# EAGLE design ExpansionBoardV1 (EAGLE 7.3.0)
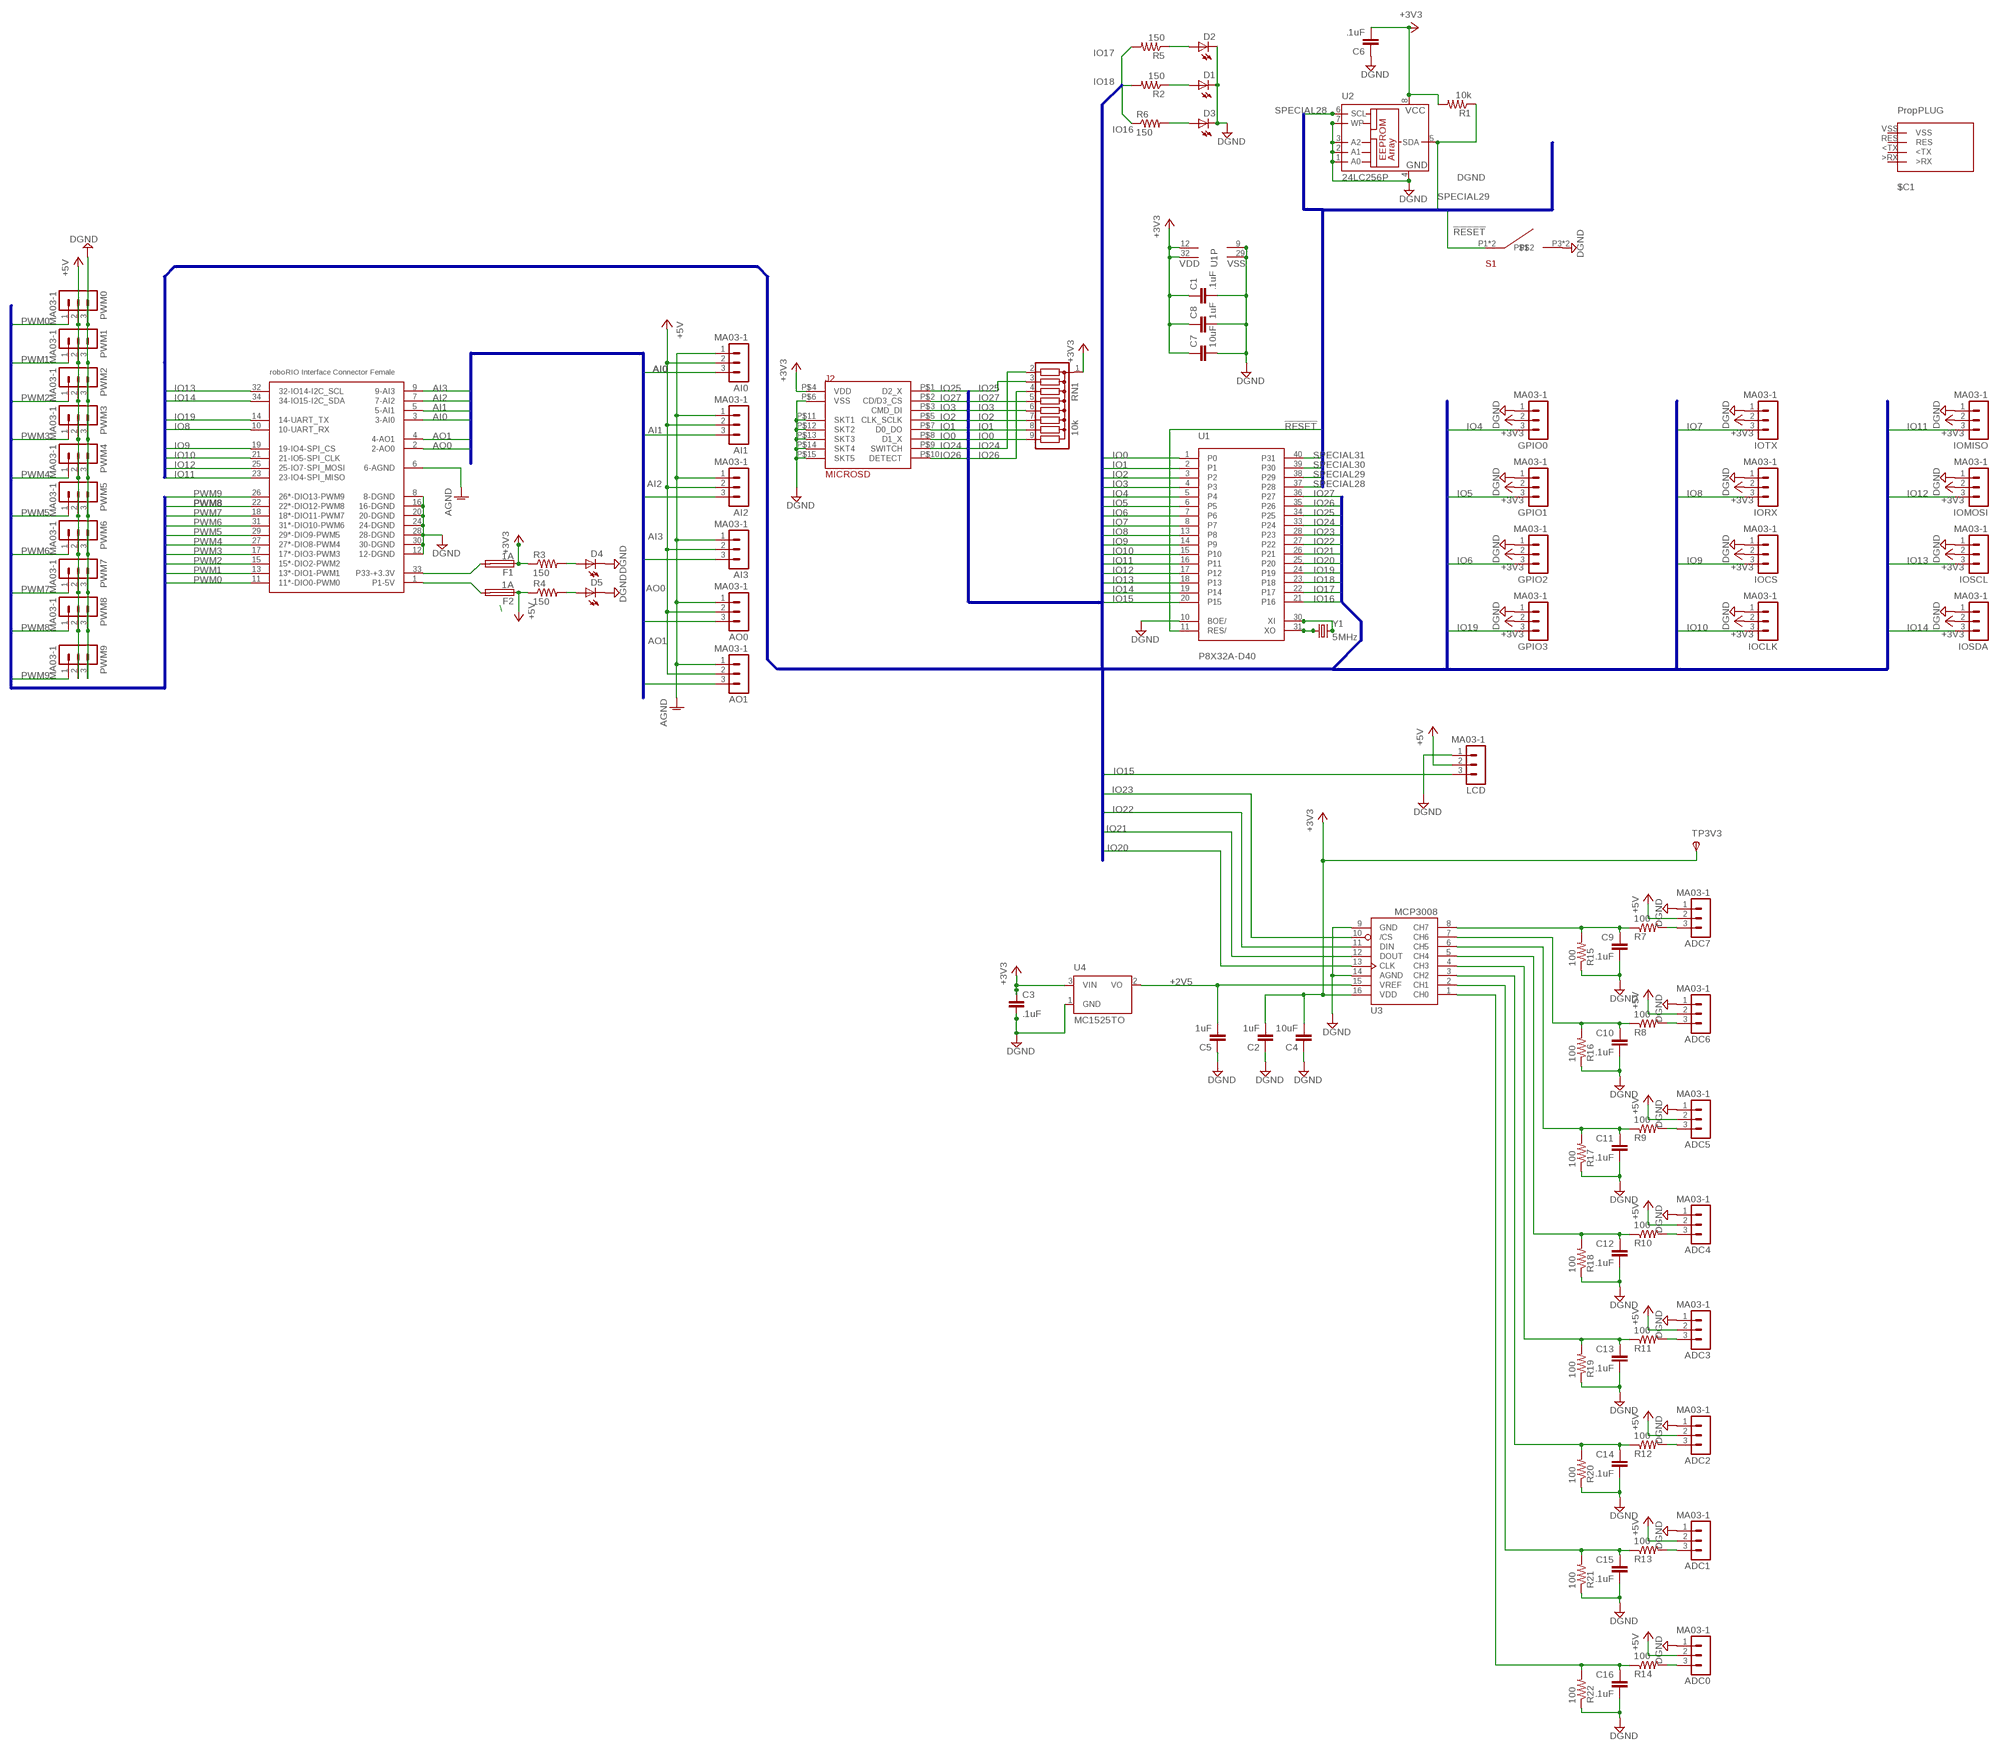
[diagram p0: schematic, sheet 1]

## Parts
ADC0  MA03-1  [MA03-1]
ADC1  MA03-1  [MA03-1]
ADC2  MA03-1  [MA03-1]
ADC3  MA03-1  [MA03-1]
ADC4  MA03-1  [MA03-1]
ADC5  MA03-1  [MA03-1]
ADC6  MA03-1  [MA03-1]
ADC7  MA03-1  [MA03-1]
AI0  MA03-1  [MA03-1]
AI1  MA03-1  [MA03-1]
AI2  MA03-1  [MA03-1]
AI3  MA03-1  [MA03-1]
AO0  MA03-1  [MA03-1]
AO1  MA03-1  [MA03-1]
C1  .1uF  C5/2.5  [C5B2.5]
C2  1uF  C5/2.5  [C5B2.5]
C3  .1uF  C5/2.5  [C5B2.5]
C4  10uF  C5/2.5  [C5B2.5]
C5  1uF  C5/2.5  [C5B2.5]
C6  .1uF  C5/2.5  [C5B2.5]
C7  10uF  C5/2.5  [C5B2.5]
C8  1uF  C5/2.5  [C5B2.5]
C9  .1uF  C5/2.5  [C5B2.5]
C10  .1uF  C5/2.5  [C5B2.5]
C11  .1uF  C5/2.5  [C5B2.5]
C12  .1uF  C5/2.5  [C5B2.5]
C13  .1uF  C5/2.5  [C5B2.5]
C14  .1uF  C5/2.5  [C5B2.5]
C15  .1uF  C5/2.5  [C5B2.5]
C16  .1uF  C5/2.5  [C5B2.5]
D1  LED5MM  [LED5MM]
D2  LED5MM  [LED5MM]
D3  LED5MM  [LED5MM]
D4  LED5MM  [LED5MM]
D5  LED5MM  [LED5MM]
F1  1A  TR5  [TR5]
F2  1A  TR5  [TR5]
GPIO0  MA03-1  [MA03-1]
GPIO1  MA03-1  [MA03-1]
GPIO2  MA03-1  [MA03-1]
GPIO3  MA03-1  [MA03-1]
IOCLK  MA03-1  [MA03-1]
IOCS  MA03-1  [MA03-1]
IOMISO  MA03-1  [MA03-1]
IOMOSI  MA03-1  [MA03-1]
IORX  MA03-1  [MA03-1]
IOSCL  MA03-1  [MA03-1]
IOSDA  MA03-1  [MA03-1]
IOTX  MA03-1  [MA03-1]
J1  RRINTERFACE-FEMALE  [RRINT-FEMALE]
J2  MICROSD  [MICRO_SD_PUSH-PUSH]
LCD  MA03-1  [MA03-1]
P1  PROP_PLUG  [PROP_PLUG]
PWM0  MA03-1  [MA03-1]
PWM1  MA03-1  [MA03-1]
PWM2  MA03-1  [MA03-1]
PWM3  MA03-1  [MA03-1]
PWM4  MA03-1  [MA03-1]
PWM5  MA03-1  [MA03-1]
PWM6  MA03-1  [MA03-1]
PWM7  MA03-1  [MA03-1]
PWM8  MA03-1  [MA03-1]
PWM9  MA03-1  [MA03-1]
R1  10k  R-US_0204/7  [0204/7]
R2  150  R-US_0204/7  [0204/7]
R3  150  R-US_0204/7  [0204/7]
R4  150  R-US_0204/7  [0204/7]
R5  150  R-US_0204/7  [0204/7]
R6  150  R-US_0204/7  [0204/7]
R7  100  R-US_0204/7  [0204/7]
R8  100  R-US_0204/7  [0204/7]
R9  100  R-US_0204/7  [0204/7]
R10  100  R-US_0204/7  [0204/7]
R11  100  R-US_0204/7  [0204/7]
R12  100  R-US_0204/7  [0204/7]
R13  100  R-US_0204/7  [0204/7]
R14  100  R-US_0204/7  [0204/7]
R15  100  R-US_0204/7  [0204/7]
R16  100  R-US_0204/7  [0204/7]
R17  100  R-US_0204/7  [0204/7]
R18  100  R-US_0204/7  [0204/7]
R19  100  R-US_0204/7  [0204/7]
R20  100  R-US_0204/7  [0204/7]
R21  100  R-US_0204/7  [0204/7]
R22  100  R-US_0204/7  [0204/7]
RN1  10k  G08R  [SIL9]
S1  BUTTON  [RESETBUTTON300000MILLION]
TP3V3  TPSPAD1-13  [P1-13]
U1  P8X32A-D40  [P8X32A-D40]
U2  24LC256P  [DIL8]
U3  MCP3008  [DIL16]
U4  MC1525TO  [TO92]
U$1  24LC256(MICROCHIP)  [24LC256]  (not placed on a sheet)
U$2  24LC256(MICROCHIP)  [24LC256]  (not placed on a sheet)
Y1  5MHz  CRYSTALHC49U70  [HC49U70]

## Nets
!RESET: S1.P1 S1.P2 U1.11(RES/)
+2V5: C5.2 U3.15(VREF) U4.2(VO)
+3V3: C1.1 C2.2 C3.1 C4.2 C6.2 C7.1 C8.1 F1.1 GPIO0.2 GPIO1.2 GPIO2.2 GPIO3.2 IOCLK.2 IOCS.2 IOMISO.2 IOMOSI.2 IORX.2 IOSCL.2 IOSDA.2 IOTX.2 J2.P$4(VDD) R1.2 R3.1 RN1.1 TP3V3.TP(PP) U1.12(VDD) U1.32(VDD) U2.8(VCC) U3.16(VDD) U4.3(VIN)
+5V: ADC0.2 ADC1.2 ADC2.2 ADC3.2 ADC4.2 ADC5.2 ADC6.2 ADC7.2 AI0.2 AI1.2 AI2.2 AI3.2 AO0.2 AO1.2 F2.1 LCD.2 PWM0.2 PWM1.2 PWM2.2 PWM3.2 PWM4.2 PWM5.2 PWM6.2 PWM7.2 PWM8.2 PWM9.2 R4.1
AGND: AI0.1 AI1.1 AI2.1 AI3.1 AO0.1 AO1.1 J1.6(6-AGND)
AI0: AI0.3 J1.3(3-AI0)
AI1: AI1.3 J1.5(5-AI1)
AI2: AI2.3 J1.7(7-AI2)
AI3: AI3.3 J1.9(9-AI3)
AO0: AO0.3 J1.2(2-AO0)
AO1: AO1.3 J1.4(4-AO1)
DGND: ADC0.1 ADC1.1 ADC2.1 ADC3.1 ADC4.1 ADC5.1 ADC6.1 ADC7.1 C1.2 C2.1 C3.2 C4.1 C5.1 C6.1 C7.2 C8.2 C9.2 C10.2 C11.2 C12.2 C13.2 C14.2 C15.2 C16.2 D1.K(C) D2.K(C) D3.K(C) D4.K(C) D5.K(C) GPIO0.1 GPIO1.1 GPIO2.1 GPIO3.1 IOCLK.1 IOCS.1 IOMISO.1 IOMOSI.1 IORX.1 IOSCL.1 IOSDA.1 IOTX.1 J1.8(8-DGND) J1.12(12-DGND) J1.16(16-DGND) J1.20(20-DGND) J1.24(24-DGND) J1.28(28-DGND) J1.30(30-DGND) J2.P$6(VSS) J2.P$11(SKT1) J2.P$12(SKT2) J2.P$13(SKT3) J2.P$14(SKT4) J2.P$15(SKT5) LCD.1 PWM0.3 PWM1.3 PWM2.3 PWM3.3 PWM4.3 PWM5.3 PWM6.3 PWM7.3 PWM8.3 PWM9.3 R15.1 R16.1 R17.1 R18.1 R19.1 R20.1 R21.1 R22.1 S1.P3 S1.P4 U1.9(VSS) U1.10(BOE/) U1.29(VSS) U2.1(A0) U2.2(A1) U2.3(A2) U2.4(GND) U2.7(WP) U3.9(GND) U3.14(AGND) U4.1(GND)
IO0: J2.P$8(D1_X) RN1.9 U1.1(P0)
IO1: J2.P$7(D0_DO) RN1.8 U1.2(P1)
IO2: J2.P$5(CLK_SCLK) RN1.7 U1.3(P2)
IO3: J2.P$3(CMD_DI) RN1.6 U1.4(P3)
IO4: GPIO0.3 U1.5(P4)
IO5: GPIO1.3 U1.6(P5)
IO6: GPIO2.3 U1.7(P6)
IO7: IOTX.3 U1.8(P7)
IO8: IORX.3 J1.10(10-UART_RX) U1.13(P8)
IO9: IOCS.3 J1.19(19-IO4-SPI_CS) U1.14(P9)
IO10: IOCLK.3 J1.21(21-IO5-SPI_CLK) U1.15(P10)
IO11: IOMISO.3 J1.23(23-IO4-SPI_MISO) U1.16(P11)
IO12: IOMOSI.3 J1.25(25-IO7-SPI_MOSI) U1.17(P12)
IO13: IOSCL.3 J1.32(32-IO14-I2C_SCL) U1.18(P13)
IO14: IOSDA.3 J1.34(34-IO15-I2C_SDA) U1.19(P14)
IO15: LCD.3 U1.20(P15)
IO16: R6.1 U1.21(P16)
IO17: R5.2 U1.22(P17)
IO18: R2.2 U1.23(P18)
IO19: GPIO3.3 J1.14(14-UART_TX) U1.24(P19)
IO20: U1.25(P20) U3.13(CLK)
IO21: U1.26(P21) U3.12(DOUT)
IO22: U1.27(P22) U3.11(DIN)
IO23: U1.28(P23) U3.10(/CS)
IO24: J2.P$9(SWITCH) RN1.2 U1.33(P24)
IO25: J2.P$1(D2_X) RN1.3 U1.34(P25)
IO26: J2.P$10(DETECT) RN1.4 U1.35(P26)
IO27: J2.P$2(CD/D3_CS) RN1.5 U1.36(P27)
L1: D4.A R3.2
N$1: U1.31(XO) Y1.1
N$2: U1.30(XI) Y1.2
N$4: D5.A R4.2
N$5: F1.2 J1.33(P33-+3.3V)
N$7: ADC1.3 R13.2
N$8: C16.1 R14.1 R22.2 U3.1(CH0)
N$9: C15.1 R13.1 R21.2 U3.2(CH1)
N$10: C13.1 R11.1 R19.2 U3.4(CH3)
N$12: D3.A R6.2
N$13: D1.A R2.1
N$14: D2.A R5.1
N$15: F2.2 J1.1(P1-5V)
N$16: C14.1 R12.1 R20.2 U3.3(CH2)
N$17: C12.1 R10.1 R18.2 U3.5(CH4)
N$22: ADC2.3 R12.2
N$25: ADC3.3 R11.2
N$29: ADC4.3 R10.2
N$30: C11.1 R9.1 R17.2 U3.6(CH5)
N$31: ADC5.3 R9.2
N$33: ADC0.3 R14.2
N$34: C9.1 R7.1 R15.2 U3.8(CH7)
N$35: ADC6.3 R8.2
N$36: ADC7.3 R7.2
N$40: C10.1 R8.1 R16.2 U3.7(CH6)
PWM0: J1.11(11*-DIO0-PWM0) PWM0.1
PWM1: J1.13(13*-DIO1-PWM1) PWM1.1
PWM2: J1.15(15*-DIO2-PWM2) PWM2.1
PWM3: J1.17(17*-DIO3-PWM3) PWM3.1
PWM4: J1.27(27*-DIO8-PWM4) PWM4.1
PWM5: J1.29(29*-DIO9-PWM5) PWM5.1
PWM6: J1.31(31*-DIO10-PWM6) PWM6.1
PWM7: J1.18(18*-DIO11-PWM7) PWM7.1
PWM8: J1.22(22*-DIO12-PWM8) PWM8.1
PWM9: J1.26(26*-DIO13-PWM9) PWM9.1
SPECIAL28: U1.37(P28) U2.6(SCL)
SPECIAL29: R1.1 U1.38(P29) U2.5(SDA)
SPECIAL30: U1.39(P30)
SPECIAL31: U1.40(P31)
Unconnected: P1.<TX P1.>RX P1.RES P1.VSS

## Buses
SPECIAL[28..31],!RESET
IO[0..31],UART_TX,UART_RX,I2C_SCL,I2C_SDA
IO[0..31],AI[0..3],AO[0..1],DIO[0..3],DIO[8..13],UART_TX,UART_RX,IO0,I2C_SCL,I2C_SDA
PWM[0..9]

## Notes on the sheet
- \

## Library data of the parts
ADC0 ADC1-ADC7 AI0 AI1-AI3 AO0 AO1 GPIO0 GPIO1-GPIO3 IOCLK IOCS IOMISO IOMOSI IORX IOSCL IOSDA IOTX LCD PWM0 PWM1-PWM9 = con-lstb-modified:MA03-1: PIN HEADER; OC_FARNELL: unknown; OC_NEWARK: unknown
C1-C16 = capacitor-wima:C: CAPACITOR naming: grid - package width
D1-D5 = led:LED: LED OSRAM: - CHIPLED LG R971, LG N971, LY N971, LG Q971, LY Q971, LO R971, LY R971 LH N974, LH R974 LS Q976, LO Q976, LY Q976 LO Q996 - Hyper CHIPLED LW Q18S LB Q993, LB Q99A, LB R99A - SideLED LS A670, LO A670, LY A670, LG A670, LP A670 LB A673, LV A673, LT A673, LW A673 LH A674 LY A675 LS A676, LA A676, LO A676, LY A676, LW A676 LS A679, LY A679, LG A679 - Hyper Micro SIDELED® LS Y876, LA Y876, LO Y876, LY Y876 LT Y87S - SmartLED LW L88C, LW L88S LB L89C, LB L89S, LG L890 LS L89K, LO L89K, LY L89K LS L896, LA L896, LO L896, LY L896 - TOPLED LS T670, LO T670, LY T670, LG T670, LP T670 LSG T670, LSP T670, LSY T670, LOP T670, LYG T670 LG T671, LOG T671, LSG T671 LB T673, LV T673, LT T673, LW T673 LH T674 LS T676, LA T676, LO T676, LY T676, LB T676, LH T676, LSB T676, LW T676 LB T67C, LV T67C, LT T67C, LS T67K, LO T67K, LY T67K, LW E67C LS E67B, LA E67B, LO E67B, LY E67B, LB E67C, LV E67C, LT E67C LW T67C LS T679, LY T679, LG T679 LS T770, LO T770, LY T770, LG T770, LP T770 LB T773, LV T773, LT T773, LW T773 LH T774 LS E675, LA E675, LY E675, LS T675 LS T776, LA T776, LO T776, LY T776, LB T776 LHGB T686 LT T68C, LB T68C - Hyper Mini TOPLED® LB M676 - Mini TOPLED Santana® LG M470 LS M47K, LO M47K, LY M47K Source: http://www.osram.convergy.de LUXEON: - LUMILED® LXK2-PW12-R00, LXK2-PW12-S00, LXK2-PW14-U00, LXK2-PW14-V00 LXK2-PM12-R00, LXK2-PM12-S00, LXK2-PM14-U00 LXK2-PE12-Q00, LXK2-PE12-R00, LXK2-PE12-S00, LXK2-PE14-T00, LXK2-PE14-U00 LXK2-PB12-K00, LXK2-PB12-L00, LXK2-PB12-M00, LXK2-PB14-N00, LXK2-PB14-P00, LXK2-PB14-Q00 LXK2-PR12-L00, LXK2-PR12-M00, LXK2-PR14-Q00, LXK2-PR14-R00 LXK2-PD12-Q00, LXK2-PD12-R00, LXK2-PD12-S00 LXK2-PH12-R00, LXK2-PH12-S00 LXK2-PL12-P00, LXK2-PL12-Q00, LXK2-PL12-R00 Source: www.luxeon.com KINGBRIGHT: KA-3528ASYC Source: www.kingbright.com
F1 F2 = fuse:TR5: FUSE Wickmann; OC_FARNELL: unknown; OC_NEWARK: unknown
J1 = RoboRioConnector:RRINTERFACE-FEMALE
J2 = MicroSdSocket:MICROSD
P1 = PropPlug:PROP_PLUG: Propeller Plug This is a simple Propeller Plug (PropPLUG) design.
R1-R22 = resistor:R-US_: RESISTOR, American symbol
RN1 = resistor-sil:G08R: SIL RESISTOR; OC_FARNELL: unknown; OC_NEWARK: unknown
S1 = RESETBUTTON3000:BUTTON
TP3V3 = testpad:TPS: TEST PIN
U1 = parallax_propeller (1):P8X32A-D40
U2 = microchip:24*: Serial EEPROM I2C; MF: MICROCHIP; MPN: 24LC256-E/P; OC_FARNELL: 9757970; OC_NEWARK: 92C7169
U3 = adafruit:MCP3008
U4 = microchip:MC15*: 2.5V and 4.096V Voltage References Source: http://www.microchip.com .. 21653b.pdf; OC_FARNELL: unknown; OC_NEWARK: unknown
U$1 U$2 = 24LC256:24LC256(MICROCHIP)
Y1 = crystal:CRYSTAL: CRYSTAL; OC_FARNELL: unknown; OC_NEWARK: unknown

## Board
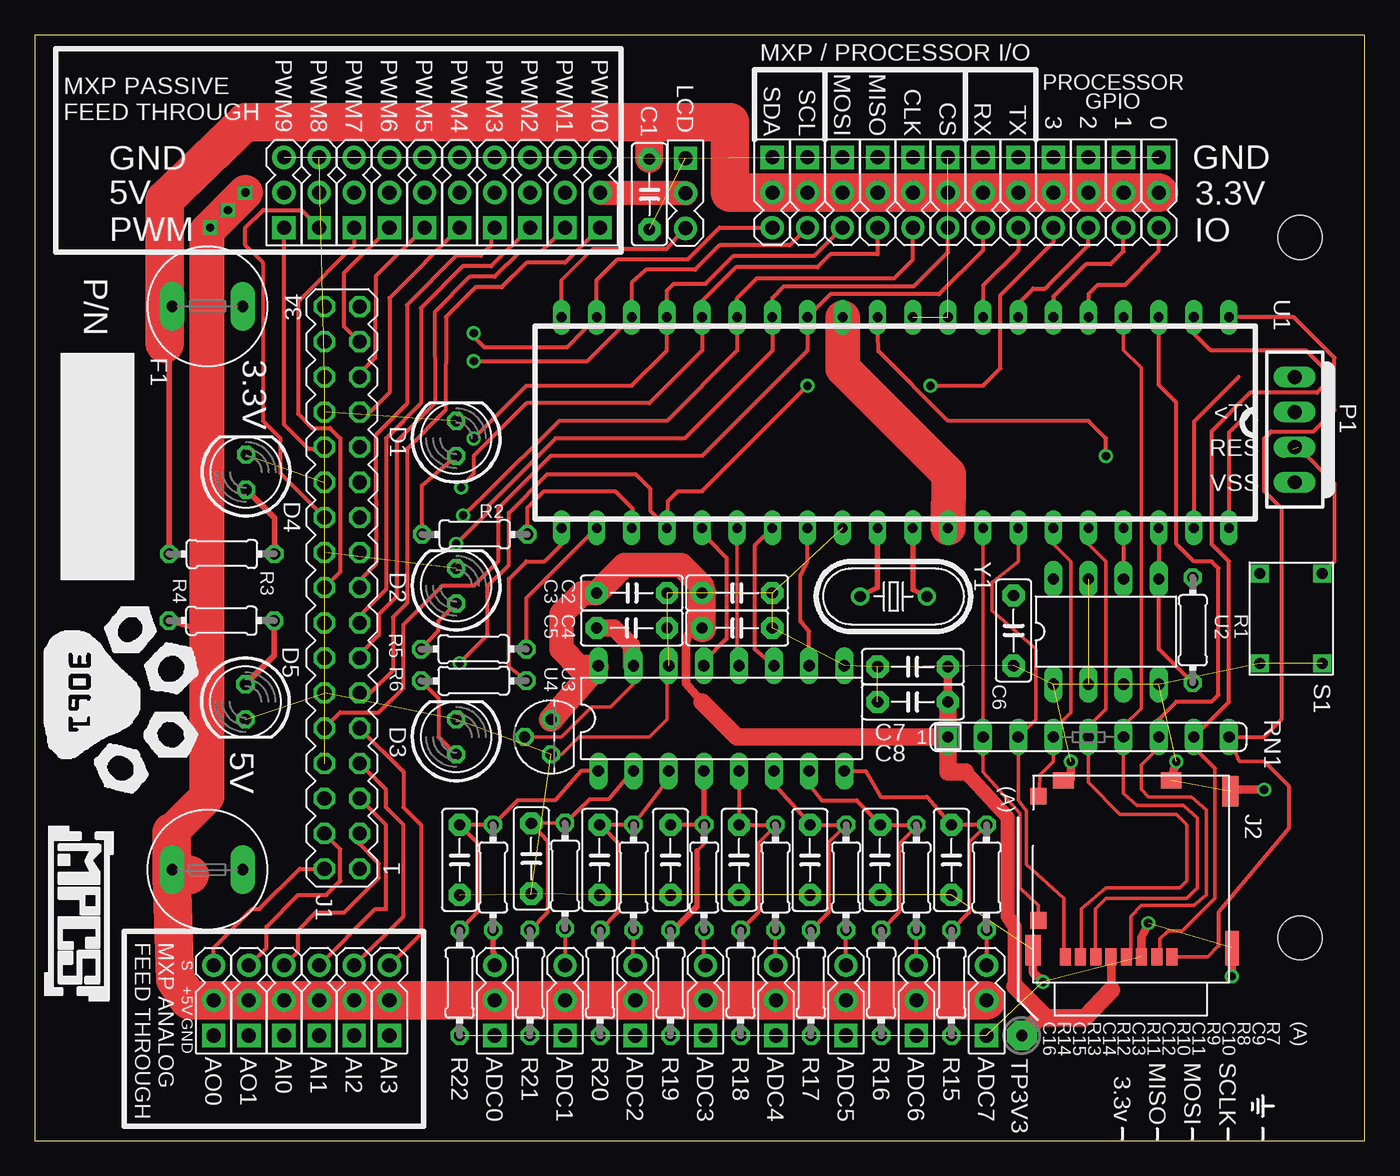
[diagram p1: board, top side]
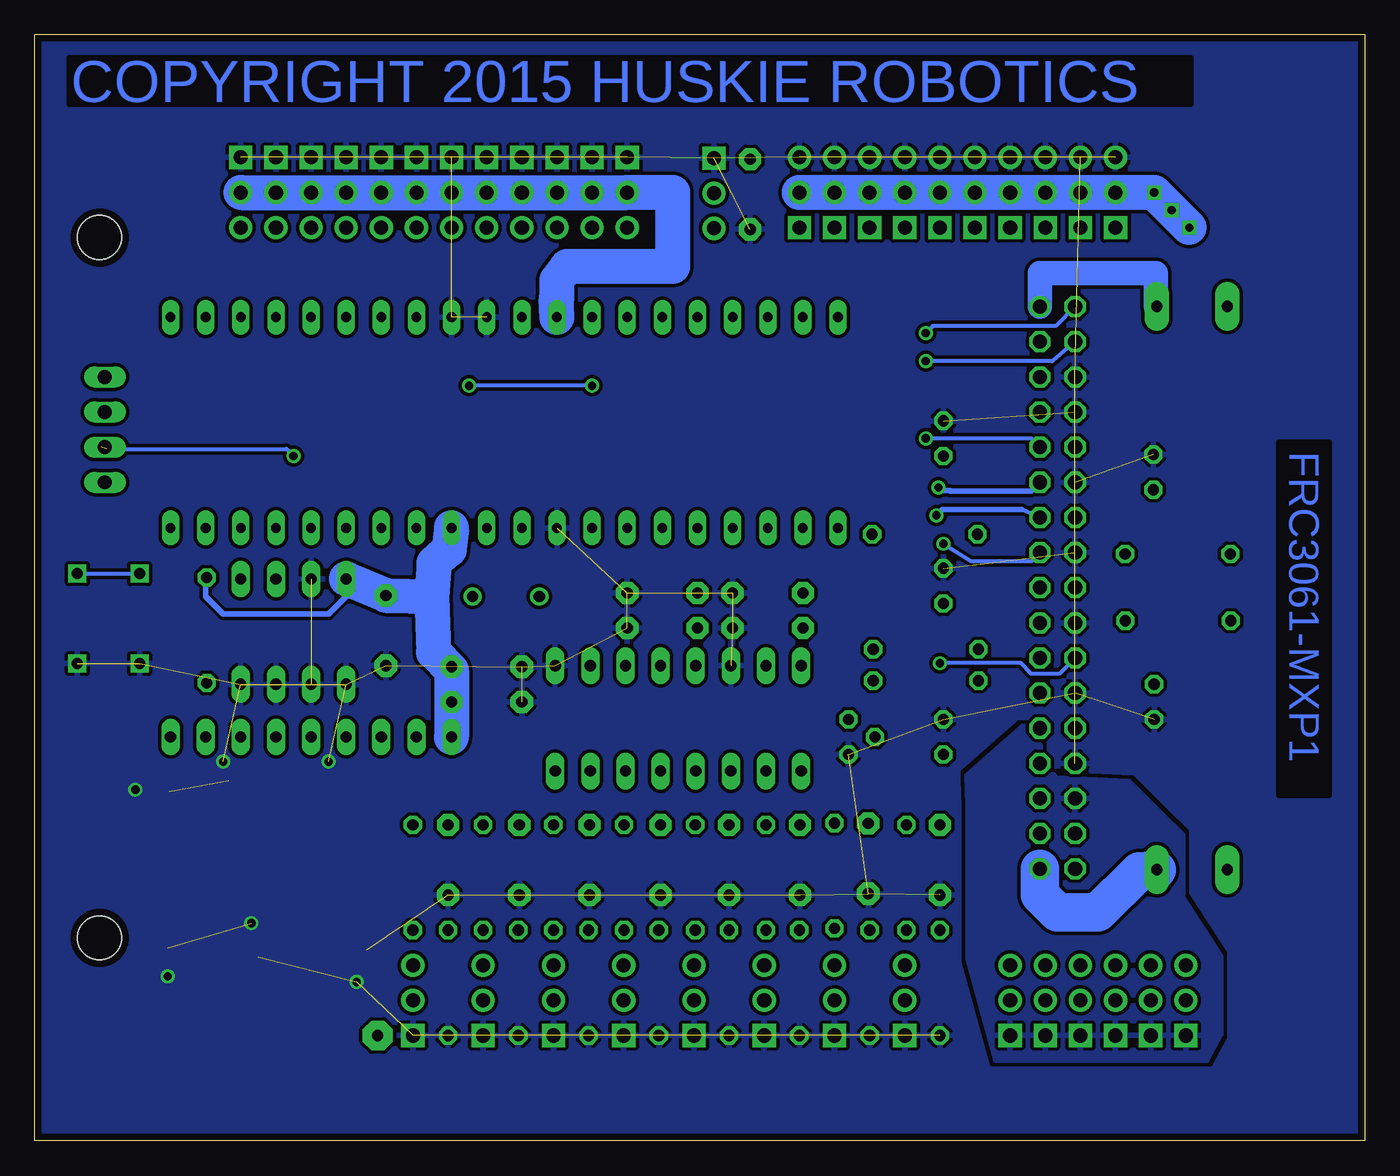
[diagram p2: board, bottom side, seen from below]

Size 96.19 x 80 mm. Coordinates in mm from the lower left corner, seen from the top.
Outline: 0,0 96.19,0 96.19,80 0,80 0,0
Copper layers (1*16): Top 0.035mm / dielectric 1.5mm / Bottom 0.035mm
Design rules "defaultTemp": minimum track width 10mil, minimum drill 23mil, track to track 8mil, track to pad 8mil, pad to pad 8mil, via to via 8mil, smd to smd 8mil, copper to edge 20mil, drill to drill 8mil, minimum pad ring 10mil, minimum via ring 8mil, stop-mask expansion 4mil, vias tented up to drill 0mil, thermal gap 10mil

### Footprints (pad centres in the part's own frame; a part is rotated, then mirrored left to right if it is on the bottom)
MA03-1 = drill 1.016 pad 1.676 square: 1 -2.54,0 | drill 1.016 pad 1.676: 2 0,0; 3 2.54,0
C5B2.5 = drill 0.813 pad 1.6 octagon: 1 -2.54,0; 2 2.54,0
LED5MM = drill 0.813 octagon: A -1.27,0; K 1.27,0
TR5 = drill 0.813 pad 1.778 long: 1 -2.54,0; 2 2.54,0
RRINT-FEMALE = drill 1.016 octagon: 1 -20.32,-1.27; 2 -20.32,1.27; 3 -17.78,-1.27; 4 -17.78,1.27; 5 -15.24,-1.27; 6 -15.24,1.27; 7 -12.7,-1.27; 8 -12.7,1.27; 9 -10.16,-1.27; 10 -10.16,1.27; 11 -7.62,-1.27; 12 -7.62,1.27; 13 -5.08,-1.27; 14 -5.08,1.27; 15 -2.54,-1.27; 16 -2.54,1.27; 17 0,-1.27; 18 0,1.27; 19 2.54,-1.27; 20 2.54,1.27; 21 5.08,-1.27; 22 5.08,1.27; 23 7.62,-1.27; 24 7.62,1.27; 25 10.16,-1.27; 26 10.16,1.27; 27 12.7,-1.27; 28 12.7,1.27; 29 15.24,-1.27; 30 15.24,1.27; 31 17.78,-1.27; 32 17.78,1.27; 33 20.32,-1.27; 34 20.32,1.27 | hole 3.175: -25.324,-69.266; 25.324,-69.266
MICRO_SD_PUSH-PUSH = smd 0.8 x 1.24: P$1 5.1,5.73; P$2 4,5.73; P$3 2.9,5.73; P$4 1.8,5.73; P$5 0.7,5.73; P$6 -0.4,5.73; P$7 -1.5,5.73; P$8 -2.6,5.73 | smd 1.16 x 1.25: P$9 7.04,3.1 | smd 1.16 x 1.2: P$10 7.04,-5.88 | smd 1.15 x 2.2: P$11 7.43,5.25; P$13 -6.84,-6.23 | smd 0.95 x 2.5: P$12 -6.95,5.1 | smd 1.5 x 1.15: P$14 -2.54,-7.03; P$15 5.24,-7.03
PROP_PLUG = drill 1 long: <TX 0,-5.08; >RX 0,-7.62; RES 0,-2.54; VSS 0,0
0204/7 = drill 0.813 octagon: 1 -3.81,0; 2 3.81,0
SIL9 = drill 0.813 long: 1 -10.16,0; 2 -7.62,0; 3 -5.08,0; 4 -2.54,0; 5 0,0; 6 2.54,0; 7 5.08,0; 8 7.62,0; 9 10.16,0
RESETBUTTON300000MILLION = drill 0.8 square: P1 3.25,2.05; P2 3.25,-2.45; P3 -3.25,2.05; P4 -3.25,-2.45
P1-13 = drill 0.8 pad 2.159 octagon: TP 0,0
P8X32A-D40 = drill 0.7 pad 1.27 long: 1 -7.62,23.495; 2 -7.62,20.955; 3 -7.62,18.415; 4 -7.62,15.875; 5 -7.62,13.335; 6 -7.62,10.795; 7 -7.62,8.255; 8 -7.62,5.715; 9 -7.62,3.175; 10 -7.62,0.635; 11 -7.62,-1.905; 12 -7.62,-4.445; 13 -7.62,-6.985; 14 -7.62,-9.525; 15 -7.62,-12.065; 16 -7.62,-14.605; 17 -7.62,-17.145; 18 -7.62,-19.685; 19 -7.62,-22.225; 20 -7.62,-24.765; 21 7.62,-24.765; 22 7.62,-22.225; 23 7.62,-19.685; 24 7.62,-17.145; 25 7.62,-14.605; 26 7.62,-12.065; 27 7.62,-9.525; 28 7.62,-6.985; 29 7.62,-4.445; 30 7.62,-1.905; 31 7.62,0.635; 32 7.62,3.175; 33 7.62,5.715; 34 7.62,8.255; 35 7.62,10.795; 36 7.62,13.335; 37 7.62,15.875; 38 7.62,18.415; 39 7.62,20.955; 40 7.62,23.495
DIL8 = drill 0.813 long: 1 -3.81,-3.81; 2 -1.27,-3.81; 3 1.27,-3.81; 4 3.81,-3.81; 5 3.81,3.81; 6 1.27,3.81; 7 -1.27,3.81; 8 -3.81,3.81
DIL16 = drill 0.813 long: 1 -8.89,-3.81; 2 -6.35,-3.81; 3 -3.81,-3.81; 4 -1.27,-3.81; 5 1.27,-3.81; 6 3.81,-3.81; 7 6.35,-3.81; 8 8.89,-3.81; 9 8.89,3.81; 10 6.35,3.81; 11 3.81,3.81; 12 1.27,3.81; 13 -1.27,3.81; 14 -3.81,3.81; 15 -6.35,3.81; 16 -8.89,3.81
TO92 = drill 0.813 octagon: 1 -1.27,0; 2 0,1.905; 3 1.27,0
24LC256 = drill 0.8 square: P$1 -3.81,1.27; P$2 -3.81,-1.27; P$3 -3.81,-3.81; P$4 -3.81,-6.35; P$5 8.89,1.27; P$6 8.89,-1.27; P$7 8.89,-3.81; P$8 8.89,-6.35
HC49U70 = drill 0.813: 1 -2.413,0; 2 2.413,0

### Placement (x,y rotation side)
ADC0  33.27,10.16 90 top
ADC1  38.35,10.16 90 top
ADC2  43.43,10.16 90 top
ADC3  48.51,10.16 90 top
ADC4  53.59,10.16 90 top
ADC5  58.67,10.16 90 top
ADC6  63.75,10.16 90 top
ADC7  68.83,10.16 90 top
AI0  18.03,10.16 90 top
AI1  20.57,10.16 90 top
AI2  23.11,10.16 90 top
AI3  25.65,10.16 90 top
AO0  12.95,10.16 90 top
AO1  15.49,10.16 90 top
C1  44.45,68.45 270 top
C2  50.8,39.62 180 top
C3  43.18,39.62 0 top
C4  50.8,37.08 180 top
C5  43.18,37.08 180 top
C6  70.79,36.91 90 top
C7  63.5,34.29 180 top
C8  63.5,31.75 180 top
C9  66.29,20.32 270 top
C10  61.14,20.32 270 top
C11  56.06,20.32 270 top
C12  50.94,20.32 270 top
C13  45.97,20.32 270 top
C14  40.84,20.32 270 top
C15  35.92,20.42 270 top
C16  30.73,20.32 270 top
D1  30.48,50.8 90 top
D2  30.48,40.13 90 top
D3  30.48,29.21 90 top
D4  15.29,48.36 90 top
D5  15.24,31.75 270 top
DRILEGEND  [DRILEGEND]  -0.35,-4.04 0 top  (outside the outline)
F1  12.5,60.35 0 top
F2  12.5,19.61 0 top
GPIO0  81.28,68.58 270 top
GPIO1  78.74,68.58 270 top
GPIO2  76.2,68.58 270 top
GPIO3  73.66,68.58 270 top
IOCLK  63.5,68.58 270 top
IOCS  66.04,68.58 270 top
IOMISO  60.96,68.58 270 top
IOMOSI  58.42,68.58 270 top
IORX  68.58,68.58 270 top
IOSCL  55.88,68.58 270 top
IOSDA  53.34,68.58 270 top
IOTX  71.12,68.58 270 top
J1  22.23,40.01 90 top
J2  79.63,19.05 180 top
LCD  47.07,68.53 270 top
P1  91.11,47.62 180 top
PWM0  40.89,68.58 90 top
PWM1  38.35,68.58 90 top
PWM2  35.81,68.58 90 top
PWM3  33.27,68.58 90 top
PWM4  30.73,68.58 90 top
PWM5  28.19,68.58 90 top
PWM6  25.65,68.58 90 top
PWM7  23.11,68.58 90 top
PWM8  20.57,68.58 90 top
PWM9  18.03,68.58 90 top
R1  83.74,36.93 90 top
R2  31.83,43.87 0 top
R3  13.54,42.44 0 top
R4  13.51,37.62 0 top
R5  31.75,35.56 0 top
R6  31.75,33.27 180 top
R7  68.83,19.05 270 top
R8  63.75,19.05 270 top
R9  58.67,19.05 270 top
R10  53.57,19.05 270 top
R11  48.41,19.05 270 top
R12  43.31,19.05 270 top
R13  38.35,19.18 270 top
R14  33.15,19.05 270 top
R15  66.29,11.43 90 top
R16  61.21,11.43 90 top
R17  56.13,11.43 90 top
R18  51.05,11.43 90 top
R19  45.97,11.43 90 top
R20  40.89,11.43 90 top
R21  35.81,11.43 90 top
R22  30.73,11.43 90 top
RN1  76.2,29.21 0 top
S1  90.65,37.77 90 top
TP3V3  71.37,7.62 0 top
U1  62.86,51.94 270 top
U2  77.47,36.83 0 top
U3  49.66,30.56 0 top
U4  37.34,29.21 90 top
U$1  -6.08,-29 0 top  (outside the outline)
U$2  -6.08,-40 0 top  (outside the outline)
Y1  62.1,39.37 180 top

### Tracks (layer width: path | path; a pad name or v marks a point on that pad's centre or on a via)
!RESET  (via drill 0.6)  (1 unrouted)
  Top 0.305: 91.36,50.16 93.98,47.55 93.98,41.91 93.14,41.07 S1.P2 | U1.11 61.01,57.1 66.04,52.07 76.2,52.07 77.47,50.8 v77.47,49.53
  Top 0.406: S1.P2 93.14,41.02 93.14,41.07
  Bottom 0.305: 90.98,50.04 77.98,50.04 v77.47,49.53 | S1.P2 S1.P1
+2V5
  Top 0.254: U4.2 38.1,29.21 40.28,31.39 41.66,31.39 43.31,33.05 U3.15
  Top 1.27: U3.15 43.18,34.37 43.18,35.81 41.91,37.08 C5.2
+3V3
  Top 0.254: U3.16 40.64,34.29 | 8.89,58.42 F1.1
  Top 0.305: U1.12 58.42,59.51
  Top 0.406: 8.89,58.42 8.89,58.17 9.4,57.66 9.73,57.33 R3.1 | 83.74,40.64 R1.2
  Top 0.61: C2.2 47.12,36.07 47.12,33.08 48.26,31.75 | J2.P$4 77.85,13.21 77.85,10.92 | RN1.1 C8.1 C7.1
  Top 1.016: 70.87,11.18 70.87,15.49 70.36,16.26 70.36,23.37 67.31,26.67
  Top 1.27: 48.26,31.75 50.8,29.21 RN1.1 | 77.85,10.92 75.95,8.89 73.15,8.89 72.9,9.14 | 72.9,9.14 70.87,11.18 | 67.31,26.67 66.04,26.67 C8.1 | TP3V3.TP 72.9,9.14
  Top 1.778: U4.3 40.64,34.29 39.37,34.29 38.1,35.56 38.1,38.1 39.62,39.62 C3.1 42.67,41.66 46.74,41.66 48.26,40.13 C2.2
  Top 2.032: C1.1 44.45,73.66 | C4.2 C2.2
  Top 2.54: 58.42,59.51 58.42,55.88 66.09,48.21 U1.32
  Top 2.794: GPIO0.2 GPIO1.2 GPIO2.2 GPIO3.2 IOTX.2 IORX.2 IOCS.2 IOCLK.2 IOMISO.2 IOMOSI.2 IOSCL.2 | IOSCL.2 IOSDA.2 | IOSCL.2 50.29,68.58 50.29,73.66 44.45,73.66 15.24,73.66 9.4,68.07 9.4,57.66
  Bottom 0.406: U2.8 73.66,39.37 74.93,38.1 82.55,38.1 83.82,39.37 83.82,40.66 R1.2
  Bottom 2.54: U1.12 58.47,60.96 58.42,60.96 58.42,62.23 57.66,63.25 50.04,63.25 50.04,68.58 IOSDA.2 81.25,68.58 | U1.32 66.2,42.89 66.2,42.77 67.31,41.78 67.47,39.37 | 67.47,39.37 67.34,35.34 66.04,34.04 RN1.1 | 67.47,39.37 C6.2 U2.8
+5V  (via drill 0.6)
  Top 0.305: 11.23,19.25 arc90 11.43,19.05
  Top 0.406: R4.1 12.45,36.83 | F2.1 10.67,19.05 9.91,19.05 | 40.92,68.58 PWM0.2
  Top 1.778: 40.92,68.58 LCD.2
  Top 2.54: v15.24,68.58 v13.97,67.31 v12.7,66.04 12.45,65.79 12.45,36.83 12.45,24.89 9.91,22.35
  Top 2.794: 9.91,22.35 9.91,19.05 10.16,11.68 11.18,10.16 AO0.2 AO1.2 AI0.2 AI1.2 AI2.2 AI3.2 ADC0.2 ADC1.2 ADC2.2 ADC3.2 ADC4.2 ADC5.2 ADC6.2 ADC7.2 | F2.1 11.23,19.25
  Bottom 2.54: v12.7,66.04 v15.24,68.58 PWM9.2 PWM8.2 PWM7.2 PWM6.2 PWM5.2 PWM4.2 PWM3.2 PWM2.2 PWM1.2 PWM0.2
AGND
  pour Bottom (isolate 0.254, rank 2): 26.67,5.84 28.7,13.21 28.7,24.38 28.78,26.42 24.54,30.15 22.85,27.67 22.83,27.6 22.83,27 22.35,26.26 17.12,26.01 13.97,22.86 13.92,22.86 13.16,22.1 13.16,17.86 13.21,17.81 13.21,17.65 10.41,13.34 10.41,7.7 11.43,5.84
AI0
  Top 0.305: AI0.3 19.05,13.72 19.05,15.24 20.32,16.51 22.38,16.51 24.89,19.02 24.89,20.07 23.49,21.46 J1.3
AI1
  Top 0.305: AI1.3 24.64,16.76 25.4,16.76 25.4,22.86 J1.5
AI2
  Top 0.305: AI2.3 26.67,16.26 26.67,22.86 25.4,24.13 25.4,25.4 J1.7
AI3
  Top 0.305: J1.9 26.67,26.67 26.67,24.13 27.94,22.86 27.94,14.99 AI3.3
AO0
  Top 0.305: AO0.3 12.95,13.97 15.75,16.76 16.26,16.76 19.18,19.68 J1.2
AO1
  Top 0.305: AO1.3 16.76,13.97 16.76,15.49 19.05,17.78 21.08,17.78 22.1,18.8 22.1,21.08 J1.4
DGND  (via drill 0.6)  (84 unrouted)
  Top 0.254: U4.1 38.1,27.94 39.37,29.21 44.45,29.21 45.72,30.48 45.72,34.24 U3.14
  Top 0.61: J2.P$11 72.2,12.19 v72.9,11.49 | J2.P$12 v86.56,11.9 | J2.P$13 87.12,25.4 v88.9,25.4 | J2.P$15 74.93,26.16 v74.93,27.43 | J2.P$14 v82.55,27.43 | J2.P$6 80.01,14.73 v80.52,15.75
  pour Bottom (isolate 0.254, rank 5): 0,80.01 95.73,79.96 96.52,0 -0.14,-0.03
IO0
  Top 0.254: J2.P$8 84.84,13.32 85.6,14.1 | 88.9,27.43 87.12,27.43 RN1.9
  Top 0.305: 88.9,27.43 90.68,25.65 90.68,22.61 85.6,16.51 85.6,14.1 | RN1.9 88.88,29.21 90.17,30.5 90.17,45.72 88.9,46.99 88.9,50.8 89.41,51.31 92.46,51.31 93.98,52.83 93.98,56.64 91.06,59.56 U1.1
IO1
  Top 0.254: J2.P$7 81.34,13.59 81.34,14.61 81.98,15.18 83,15.18 85.34,17.53 85.34,26.92
  Top 0.305: U1.2 83.87,58.34 85.06,57.15 91.95,57.15 93.22,55.88 93.22,54.61 92.71,54.1 87.88,54.1 85.09,51.31 85.09,43.18 86.36,41.91 86.36,31.75 RN1.8 83.82,28.45 85.34,26.92
IO2
  Top 0.254: J2.P$5 79.25,13.32 79.25,16.26 80.01,17.02 83.82,17.02 84.71,17.78 84.71,23.94 83.63,24.89 80.52,24.89 80.01,25.4 80.01,27.18 81.28,28.45 RN1.7 81.28,30.48
  Top 0.305: U1.3 81.28,54.66 82.55,53.39 82.55,43.18 83.82,41.91 85.09,41.91 85.6,41.4 85.6,32.26 85.09,31.75 82.55,31.75 81.28,30.48
IO3
  Top 0.254: U1.4 78.74,57.2 80.03,55.91 80.01,31.27 78.74,30 RN1.6 78.74,25.15 79.69,24.26 83.06,24.26 84.07,23.37 84.07,18.29 83.31,17.53 77.47,17.53 76.71,16.76 76.71,13.72 J2.P$3
IO4
  Top 0.305: GPIO0.3 81.28,64.36 78.82,61.9 76.86,61.9 76.2,61.24 U1.5
IO5
  Top 0.305: GPIO1.3 78.74,64.34 77.8,63.4 76.02,63.4 73.66,61.04 U1.6
IO6
  Top 0.305: U1.7 71.12,60.55 72.21,61.65 73.08,61.65 73.58,62.15 76.2,64.77 GPIO2.3
IO7
  Top 0.305: IOTX.3 71.12,64.39 68.58,61.85 U1.8
IO8
  Top 0.305: J1.10 22.1,30.99 24.89,30.99 26.67,32.77 26.67,37.34 29.46,40.13 31.75,40.13 33.53,41.91 33.53,45.74 37.31,49.53 48.26,49.53 55.88,57.15 U1.13 57.53,61.21 65.41,61.21 68.58,64.39 IORX.3
IO9  (via drill 0.6)
  Top 0.305: IOCS.3 66.04,64.26 63.58,61.8 54.18,61.8 53.34,60.96 U1.14 53.34,57.15 46.99,50.8 37.67,50.8 32.82,45.95 32.82,45.52 v30.48,43.18
  Bottom 0.305: J1.19 24.13,41.91 28.45,41.91 v30.48,43.18
IO10  (via drill 0.6)
  Top 0.305: IOCLK.3 63.5,63.73 62.15,62.38 52.22,62.38 50.8,60.96 U1.15 50.8,57.15 45.72,52.07 37.92,52.07 32.54,46.71 v30.99,45.24
  Bottom 0.305: J1.21 24.82,45.67
  Bottom 0.406: 24.82,45.67 30.56,45.67 v30.99,45.24
IO11  (via drill 0.6)
  Top 0.305: v30.84,47.24 31.75,48.26 31.75,49.53 35.56,53.34 44.45,53.34 48.26,57.15 U1.16 48.26,60.73 50.7,63.17 56.62,63.17 57.56,64.11 60.96,64.11 IOMISO.3
  Bottom 0.305: J1.23 24.13,46.99
  Bottom 0.406: 24.13,46.99 30,46.99 30,47.02 30.84,47.02 v30.84,47.24
IO12  (via drill 0.6)
  Top 0.305: U1.17 45.72,61.47 46.23,61.98 48.51,61.98 50.55,64.01 56.39,64.01 IOMOSI.3 | v31.75,50.8 35.56,54.61 43.18,54.61 45.72,57.15 U1.17 | 45.72,59.69 U1.17
  Bottom 0.305: J1.25 24.13,50.8 v31.75,50.8
IO13  (via drill 0.6)
  Top 0.305: IOSCL.3 54.61,64.77 49.53,64.77 47.75,62.99 44.2,62.99 43.18,62.05 U1.18 39.98,56.39 v31.75,56.39
  Bottom 0.305: J1.32 22.61,56.39 v31.75,56.39
IO14  (via drill 0.6)
  Top 0.305: IOSDA.3 49.53,66.04 47.24,63.75 42.16,63.75 40.64,62.23 U1.19 38.53,57.4 32.51,57.4 31.75,58.17 v31.75,58.42
  Bottom 0.305: J1.34 22.35,58.93 31.24,58.93 v31.75,58.42
IO15
  Top 0.254: 38.1,62.23 40.39,64.52
  Top 0.305: U1.20 38.1,62.23 | 40.39,64.52 45.72,64.52 47.02,66.04 LCD.3
IO16
  Top 0.305: R6.1 34.29,34.29 34.29,40.64 35.56,41.91 36.88,41.91 38.15,43.18 U1.21
IO17
  Top 0.305: R5.2 35.56,39.24 U1.22
IO18
  Top 0.305: R2.2 35.64,45.8 36.83,46.99 41.96,46.99 43.23,45.72 U1.23
IO19  (via drill 0.6)
  Top 0.305: GPIO3.3 73.66,64.97 69.85,61.16 69.85,55.88 68.58,54.61 v64.77,54.61 | v30.73,34.54 32.77,36.58 32.77,40.13 34.29,41.66 34.29,45.41 37.08,48.21 43.46,48.21 44.5,47.17 44.5,45.59 U1.24 45.77,46.23 46.53,46.99 48.26,46.99 v55.88,54.61
  Bottom 0.305: J1.14 22.1,33.78 24.13,33.78 24.89,34.54 v30.73,34.54 | v55.88,54.61 v64.77,54.61
IO20
  Top 0.305: U1.25 48.77,43.87 48.77,43.43 50.04,42.16 50.04,36.32 48.39,34.67 U3.13
IO21
  Top 0.254: U3.12 50.93,35.43 50.8,35.56 U1.26
IO22
  Top 0.305: U1.27 52.07,43.05 52.07,35.56 U3.11
IO23
  Top 0.305: U3.10 56.01,36.83 55.37,37.59 55.37,40.89 55.88,41.91 U1.28
IO24
  Top 0.254: U1.33 RN1.2 68.58,26.67 71.25,23.69 71.25,18.29 72.58,17.02 J2.P$9
  Top 0.406: J2.P$9
IO25
  Top 0.254: U1.34 71.12,41.91 69.22,40.39 69.22,38.35 72.39,35.56 72.39,30.48 RN1.3 71.12,24.64 71.72,23.88 71.72,20 74.42,17.53 74.42,13.34 J2.P$1
IO26
  Top 0.254: U1.35 73.66,43.18 74.93,41.91 74.93,30.99 73.66,29.72 RN1.4 73.66,27.43 72.72,26.49 J2.P$10
IO27
  Top 0.254: 76.2,43.18 77.47,41.91 77.47,31.24 76.2,29.97 RN1.5 76.2,25.91 78.49,23.62 82.55,23.62 83.31,22.86 83.31,18.8 82.8,18.29 77.47,18.29 75.69,16.76 75.69,13.32 J2.P$2
  Top 0.305: 76.2,43.18 U1.36
L1
  Top 0.406: R3.2 17.35,45.03 D4.A
N$1
  Top 0.406: U1.31 63.5,39.88 Y1.1
N$2
  Top 0.406: U1.30 60.96,40.01 Y1.2
N$3
  cutout Bottom: 12.57,78.23 12.57,74.96 93.7,74.96 93.7,78.33 12.57,78.33 12.57,78.28
N$4
  Top 0.406: R4.2 17.32,35.1 D5.A
N$5
  Bottom 0.406: F1.2 15.11,60.35
  Bottom 1.778: 15.11,60.35 15.11,62.74 23.49,62.74 J1.33
N$6
  cutout Bottom: 2.57,50.52 6.22,50.52 6.22,24.99 2.57,24.99
N$7
  Top 0.305: R13.2 ADC1.3
N$8
  Top 0.305: U3.1 39.5,26.75 37.64,24.64 34.93,24.64 R14.1 C16.1 32,21.59 32,16.51 R22.2
N$9
  Top 0.305: 43.03,26.49 41.48,24.7 40.14,24.7 R13.1 C15.1 37.08,21.69 37.08,16.51 R21.2
  Top 0.406: U3.2 43.03,26.49 43.23,26.67
N$10
  Top 0.254: 47.88,20.95 48.41,21.49 R11.1
  Top 0.305: R11.1 C13.1
  Top 0.406: 48.39,26.9 U3.4 48.41,26.72 R11.1 | 47.88,20.95 47.88,19.68 47.93,19.68 47.9,19.66 47.9,16.97 46.18,15.24 R19.2
N$12
  Top 0.305: R6.2 29.21,32 29.21,29.21 D3.A
N$13
  Top 0.305: R2.1 28.02,47.4 D1.A
N$14
  Top 0.305: R5.1 29.21,36.91 29.21,37.59 D2.A
N$15
  Bottom 2.794: F2.2 16.31,19.51 19.3,16.51 22.23,16.51 23.49,17.78 J1.1
N$16
  Top 0.305: C14.1 41.12,22.53 | 41.12,22.53 41.12,22.63 | 41.12,22.63 41,22.76 | 41.12,22.63 42.16,21.59 42.16,16.51 R20.2 40.82,15.16 | U3.3 45.9,26.24 R12.1 40.89,22.86 41,22.76 | 41.12,22.53 41.17,22.76 41,22.76
N$17
  Top 0.254: 52.32,21.54 53.57,22.78 R10.1
  Top 0.305: U3.5 50.94,26.57 C12.1 R10.1 | 52.32,21.54 52.32,16.51 R18.2
N$22
  Top 0.305: ADC2.3 43.28,12.85 R12.2
N$25
  Top 0.305: ADC3.3 48.41,12.8 R11.2
N$29
  Top 0.305: ADC4.3 53.57,12.72 R10.2
N$30
  Top 0.254: 57.4,21.59 R9.1
  Top 0.305: R9.1 56.31,22.86 56.13,22.86 53.72,25.53 U3.6 | 57.4,21.59 57.4,16.51 R17.2
  Top 0.406: C11.1 56.31,22.86
N$31
  Top 0.305: ADC5.3 R9.2
N$33
  Top 0.406: R14.2 33.15,13.72 33.27,13.46 ADC0.3
N$34
  Top 0.254: 67.56,21.59 R7.1
  Top 0.305: U3.8 60.1,26.75 61.19,24.89 64.52,24.89 C9.1 R7.1 | 67.56,21.59 67.56,16.51 R15.2
N$35
  Top 0.305: ADC6.3 R8.2
N$36
  Top 0.305: R7.2 ADC7.3
N$40
  Top 0.254: 62.48,21.49 63.75,22.76 R8.1
  Top 0.305: U3.7 55.88,26.62 55.88,25.91 56.9,24.64 59.44,24.64 61.14,22.94 | 61.14,22.94 C10.1 | 61.14,22.94 61.21,22.86 R8.1 | 62.48,21.49 62.48,16.51 R16.2
PWM0
  Top 0.305: PWM0.1 38.35,63.5 35.56,63.5 33.78,61.72 31.88,61.72 29.74,59.59 29.72,52.83 26.92,50.04 26.92,38.89 25.91,37.87 25.91,34.04 24.26,32.38 J1.11
PWM1
  Top 0.305: PWM1.1 36.58,64.26 35.05,64.26 33.27,62.48 31.47,62.48 28.93,59.94 28.96,53.34 26.19,50.57 26.19,39.37 24.89,38.08 24.89,36.58 23.49,35.18 J1.13
PWM2
  Top 0.305: PWM2.1 33.02,63.25 30.96,63.25 27.94,60.22 27.94,53.34 25.4,50.8 25.4,39.88 23.49,37.97 J1.15
PWM3
  Top 0.305: PWM3.1 33.02,65.79 33.02,64.77 32.26,64.01 30.48,64.01 26.92,60.45 26.92,53.31 24.66,51.05 24.69,41.71 23.49,40.51 J1.17
PWM4
  Top 0.305: PWM4.1 25.65,60.96 25.65,54.1 24.26,52.7 J1.27
PWM5
  Top 0.305: PWM5.1 24.66,62.53 24.64,56.64 23.49,55.5 J1.29
PWM6
  Top 0.305: PWM6.1 22.35,62.74 22.35,58.93 J1.31
PWM7
  Top 0.305: PWM7.1 23.11,64.77 19.05,60.71 19.05,52.58 20.07,51.56 21.34,51.56 22.1,50.8 22.1,41.15 J1.18
PWM8
  Top 0.254: 16.51,52.07 16.51,53.34 16.51,63.5
  Top 0.305: J1.22 17.78,48.26 17.78,50.8 16.51,52.07 | 16.51,63.5 15.24,64.77 15.24,66.04 16.51,67.31 19.3,67.31 PWM8.1
PWM9
  Top 0.305: J1.26 20.83,50.04 19.81,50.04 18.03,51.82 PWM9.1
SPECIAL28
  Top 0.305: U1.37 U2.6
SPECIAL29
  Top 0.305: U1.38 U2.5 81.28,35.56 R1.1
SPECIAL30
  Top 0.305: 87.05,55.24 83.82,52.02 U1.39
SPECIAL31
  Top 0.305: 87.86,52.7 86.36,51.21 86.36,44.45 86.41,44.4 U1.40

### Text on the board
Bottom: COPYRIGHT 2015 HUSKIE ROBOTICS | FRC3061-MXP1
tNames: 3.3V | P1 | 5V | (A) | R7 / C9 / R8 / C10 / R9 / C11 / R10 / C12 / R11 / C13 / R12 / C14 / R13 / C15 / R14 / C16 | (A) | MISO | MOSI | SCLK | 3.3v
Reference: 69.2 mm [2.72 in] | 2.54 mm [0.1 in] | 96 mm [3.8 in] | 2.54 mm [0.1 in] | 50.65 mm [2.00 in] | 80 mm [3.5 in]
_tsilk: MXP / PROCESSOR I/O | PROCESSOR / GPIO | MXP PASSIVE / FEED THROUGH | SDA | SCL | MOSI | MISO | CLK | CS | RX | TX | 0 / 1 / 2 / 3 | GND | GND | 5V | 3.3V | PWM | IO | P/N | MXP ANALOG / FEED THROUGH | S | +5V | GND
DrillLegend: NOTES: | 1. PRIMARY / COMPONENT SIDE SHOWN. / 2. STACKUP, 2 SIDED PLATED THROUGH HOLE. / 2. THICKNESS, .062" FINISHED, +/- .006". / 3. PLATING, 1/2 OZ. PLATED TO 1.5 OZ ON OUTER LAYERS. / 4. FINISH, SOLDER COATING. / 5. ANNULAR RING, .002" FOR EXTERNAL. / 6. SOLDERMASK, LPI, NO MASK TO APPEAR ON COMPONENT PADS. / 7. SILKSCREEN, WHITE NON-CONDUCTIVE INK. NO INK TO APPEAR ON COMPONENT PADS. / 8. STANDARD HOLE TOLERANCE +/- .005".
DrillLegend_01-16: 01-16
DrillLegend_01-20: 01-20